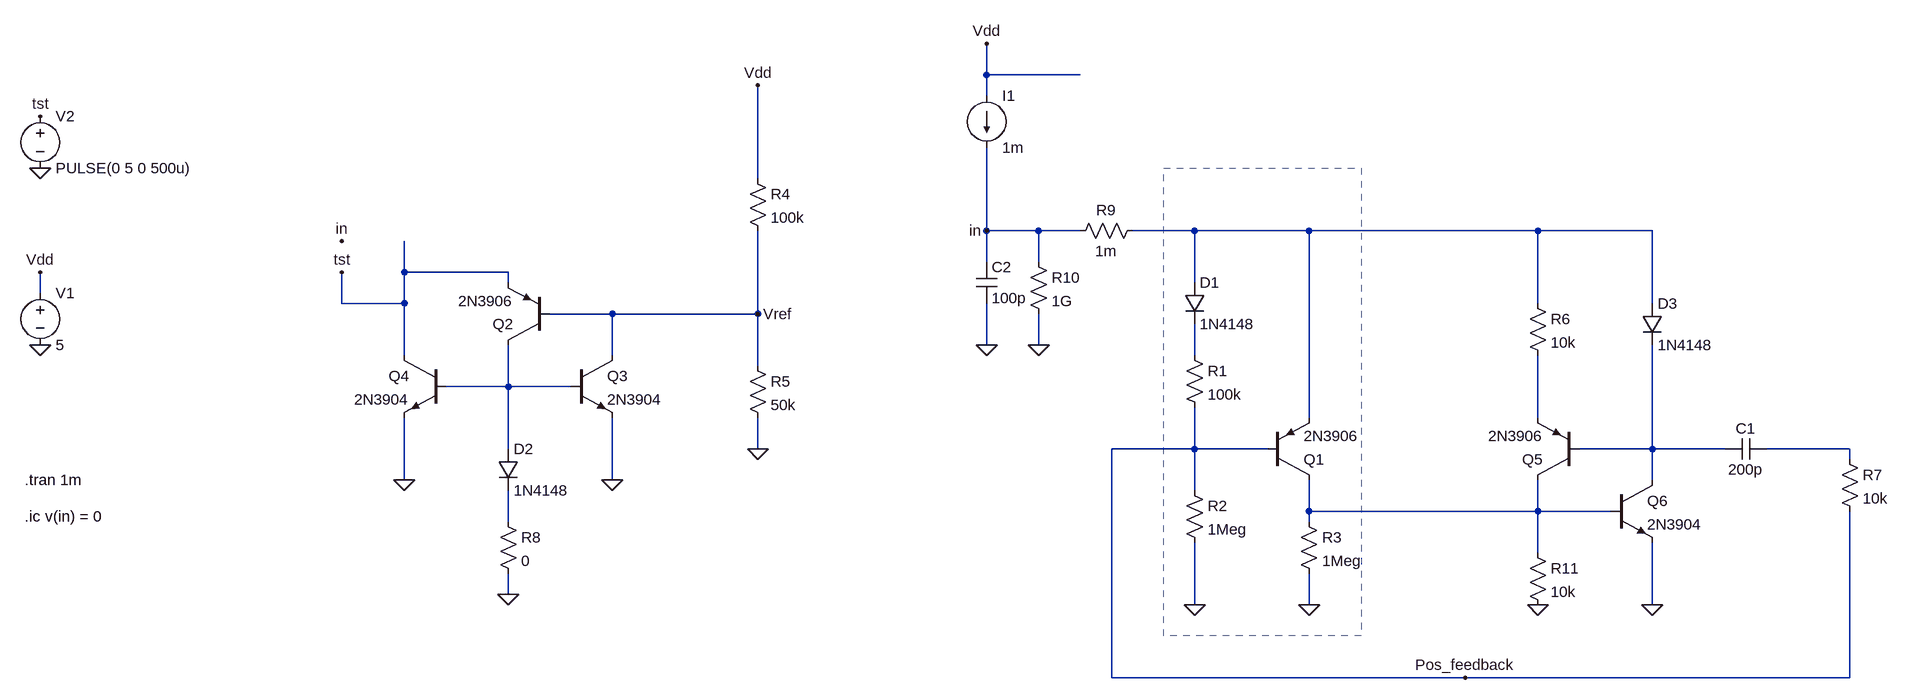
[diagram p0: schematic UJT.asc]
UJT.asc, the LTspice schematic file:
Version 4.1
SHEET 1 2564 1760
WIRE 1168 -112 1168 -160
WIRE 1312 -112 1168 -112
WIRE 1168 -80 1168 -112
WIRE 816 48 816 -96
WIRE 1168 128 1168 0
WIRE 1248 128 1168 128
WIRE 1312 128 1248 128
WIRE 1488 128 1392 128
WIRE 1664 128 1488 128
WIRE 2016 128 1664 128
WIRE 2192 128 2016 128
WIRE 1168 176 1168 128
WIRE 1248 176 1248 128
WIRE 272 192 272 144
WIRE 432 192 272 192
WIRE 432 208 432 192
WIRE 1488 208 1488 128
WIRE -288 224 -288 192
WIRE 176 240 176 192
WIRE 272 240 272 192
WIRE 272 240 176 240
WIRE 2016 240 2016 128
WIRE 2192 240 2192 128
WIRE 592 256 496 256
WIRE 816 256 816 128
WIRE 816 256 592 256
WIRE 1168 304 1168 240
WIRE 1248 304 1248 256
WIRE 272 320 272 240
WIRE 592 320 592 256
WIRE 1488 320 1488 272
WIRE 816 336 816 256
WIRE 432 368 432 304
WIRE 432 368 336 368
WIRE 528 368 432 368
WIRE 1664 416 1664 128
WIRE 2016 416 2016 320
WIRE 432 464 432 368
WIRE 816 464 816 416
WIRE 1488 464 1488 400
WIRE 1488 464 1360 464
WIRE 1600 464 1488 464
WIRE 2192 464 2192 304
WIRE 2192 464 2080 464
WIRE 2304 464 2192 464
WIRE 2496 464 2368 464
WIRE 2496 480 2496 464
WIRE 272 512 272 416
WIRE 592 512 592 416
WIRE 2192 512 2192 464
WIRE 1488 528 1488 464
WIRE 1664 560 1664 512
WIRE 2016 560 2016 512
WIRE 2016 560 1664 560
WIRE 2128 560 2016 560
WIRE 432 576 432 528
WIRE 1664 576 1664 560
WIRE 2016 624 2016 560
WIRE 432 688 432 656
WIRE 1488 704 1488 608
WIRE 1664 704 1664 656
WIRE 2192 704 2192 608
WIRE 1360 816 1360 464
WIRE 1904 816 1360 816
WIRE 2496 816 2496 560
WIRE 2496 816 1904 816
FLAG -288 304 0
FLAG 816 464 0
FLAG 592 512 0
FLAG 272 512 0
FLAG -288 192 Vdd
FLAG 432 688 0
FLAG 816 256 Vref
FLAG 816 -96 Vdd
FLAG -288 32 0
FLAG -288 -48 tst
FLAG 176 192 tst
FLAG 1168 -160 Vdd
FLAG 1664 704 0
FLAG 1488 704 0
FLAG 2192 704 0
FLAG 1904 816 Pos_feedback
FLAG 1168 304 0
FLAG 1248 304 0
FLAG 1168 128 in
FLAG 176 144 in
FLAG 2016 704 0
SYMBOL voltage -288 208 R0
WINDOW 123 0 0 Left 0
WINDOW 39 0 0 Left 0
SYMATTR InstName V1
SYMATTR Value 5
SYMBOL res 800 32 R0
SYMATTR InstName R4
SYMATTR Value 100k
SYMBOL res 800 320 R0
SYMATTR InstName R5
SYMATTR Value 50k
SYMBOL pnp 496 304 R180
SYMATTR InstName Q2
SYMATTR Value 2N3906
SYMBOL npn 528 320 R0
SYMATTR InstName Q3
SYMATTR Value 2N3904
SYMBOL npn 336 320 M0
SYMATTR InstName Q4
SYMATTR Value 2N3904
SYMBOL res 416 560 R0
SYMATTR InstName R8
SYMATTR Value 0
SYMBOL diode 416 464 R0
SYMATTR InstName D2
SYMATTR Value 1N4148
SYMBOL voltage -288 -64 R0
WINDOW 123 0 0 Left 0
WINDOW 39 0 0 Left 0
SYMATTR InstName V2
SYMATTR Value PULSE(0 5 0 500u)
SYMBOL diode 1472 208 R0
SYMATTR InstName D1
SYMATTR Value 1N4148
SYMBOL res 1472 304 R0
SYMATTR InstName R1
SYMATTR Value 100k
SYMBOL res 1472 512 R0
SYMATTR InstName R2
SYMATTR Value 1Meg
SYMBOL pnp 1600 512 M180
SYMATTR InstName Q1
SYMATTR Value 2N3906
SYMBOL res 1648 560 R0
SYMATTR InstName R3
SYMATTR Value 1Meg
SYMBOL pnp 2080 512 R180
SYMATTR InstName Q5
SYMATTR Value 2N3906
SYMBOL res 2000 224 R0
SYMATTR InstName R6
SYMATTR Value 10k
SYMBOL npn 2128 512 R0
SYMATTR InstName Q6
SYMATTR Value 2N3904
SYMBOL diode 2176 240 R0
SYMATTR InstName D3
SYMATTR Value 1N4148
SYMBOL cap 2304 448 M90
WINDOW 0 0 32 VBottom 2
WINDOW 3 32 32 VTop 2
SYMATTR InstName C1
SYMATTR Value 200p
SYMBOL res 2480 464 R0
SYMATTR InstName R7
SYMATTR Value 10k
SYMBOL res 1408 112 R90
WINDOW 0 0 56 VBottom 2
WINDOW 3 32 56 VTop 2
SYMATTR InstName R9
SYMATTR Value 1m
SYMBOL lib\\sym\\current 1168 -80 R0
WINDOW 123 0 0 Left 0
WINDOW 39 24 28 Left 2
SYMATTR InstName I1
SYMATTR Value 1m
SYMBOL cap 1152 176 R0
SYMATTR InstName C2
SYMATTR Value 100p
SYMBOL res 1232 160 R0
SYMATTR InstName R10
SYMATTR Value 1G
SYMBOL res 2000 608 R0
SYMATTR InstName R11
SYMATTR Value 10k
TEXT -312 512 Left 2 !.tran 1m
TEXT -312 568 Left 2 !.ic v(in) = 0
RECTANGLE Normal 1744 752 1440 32 2

The netlist it stands for:
* UJT.asc
V1 Vdd 0 5
R4 Vdd Vref 100k
R5 Vref 0 50k
Q2 N003 Vref tst 0 2N3906
Q3 Vref N003 0 0 2N3904
Q4 tst N003 0 0 2N3904
R8 N008 0 0
D2 N003 N008 1N4148
V2 tst 0 PULSE(0 5 0 500u)
D1 N001 N002 1N4148
R1 N002 Pos_feedback 100k
R2 Pos_feedback 0 1Meg
Q1 N007 Pos_feedback N001 0 2N3906
R3 N007 0 1Meg
Q5 N007 N005 N004 0 2N3906
R6 N001 N004 10k
Q6 N005 N007 0 0 2N3904
D3 N001 N005 1N4148
C1 N005 N006 200p
R7 N006 Pos_feedback 10k
R9 N001 in 1m
I1 Vdd in 1m
C2 in 0 100p
R10 in 0 1G
R11 N007 0 10k
.model D D
.lib standard.dio
.model NPN NPN
.model PNP PNP
.lib standard.bjt
.tran 1m
.ic v(in) = 0
.backanno
.end